# EAGLE design ai_spectra (EAGLE 6.5.0)

## Sheet 1 of 2
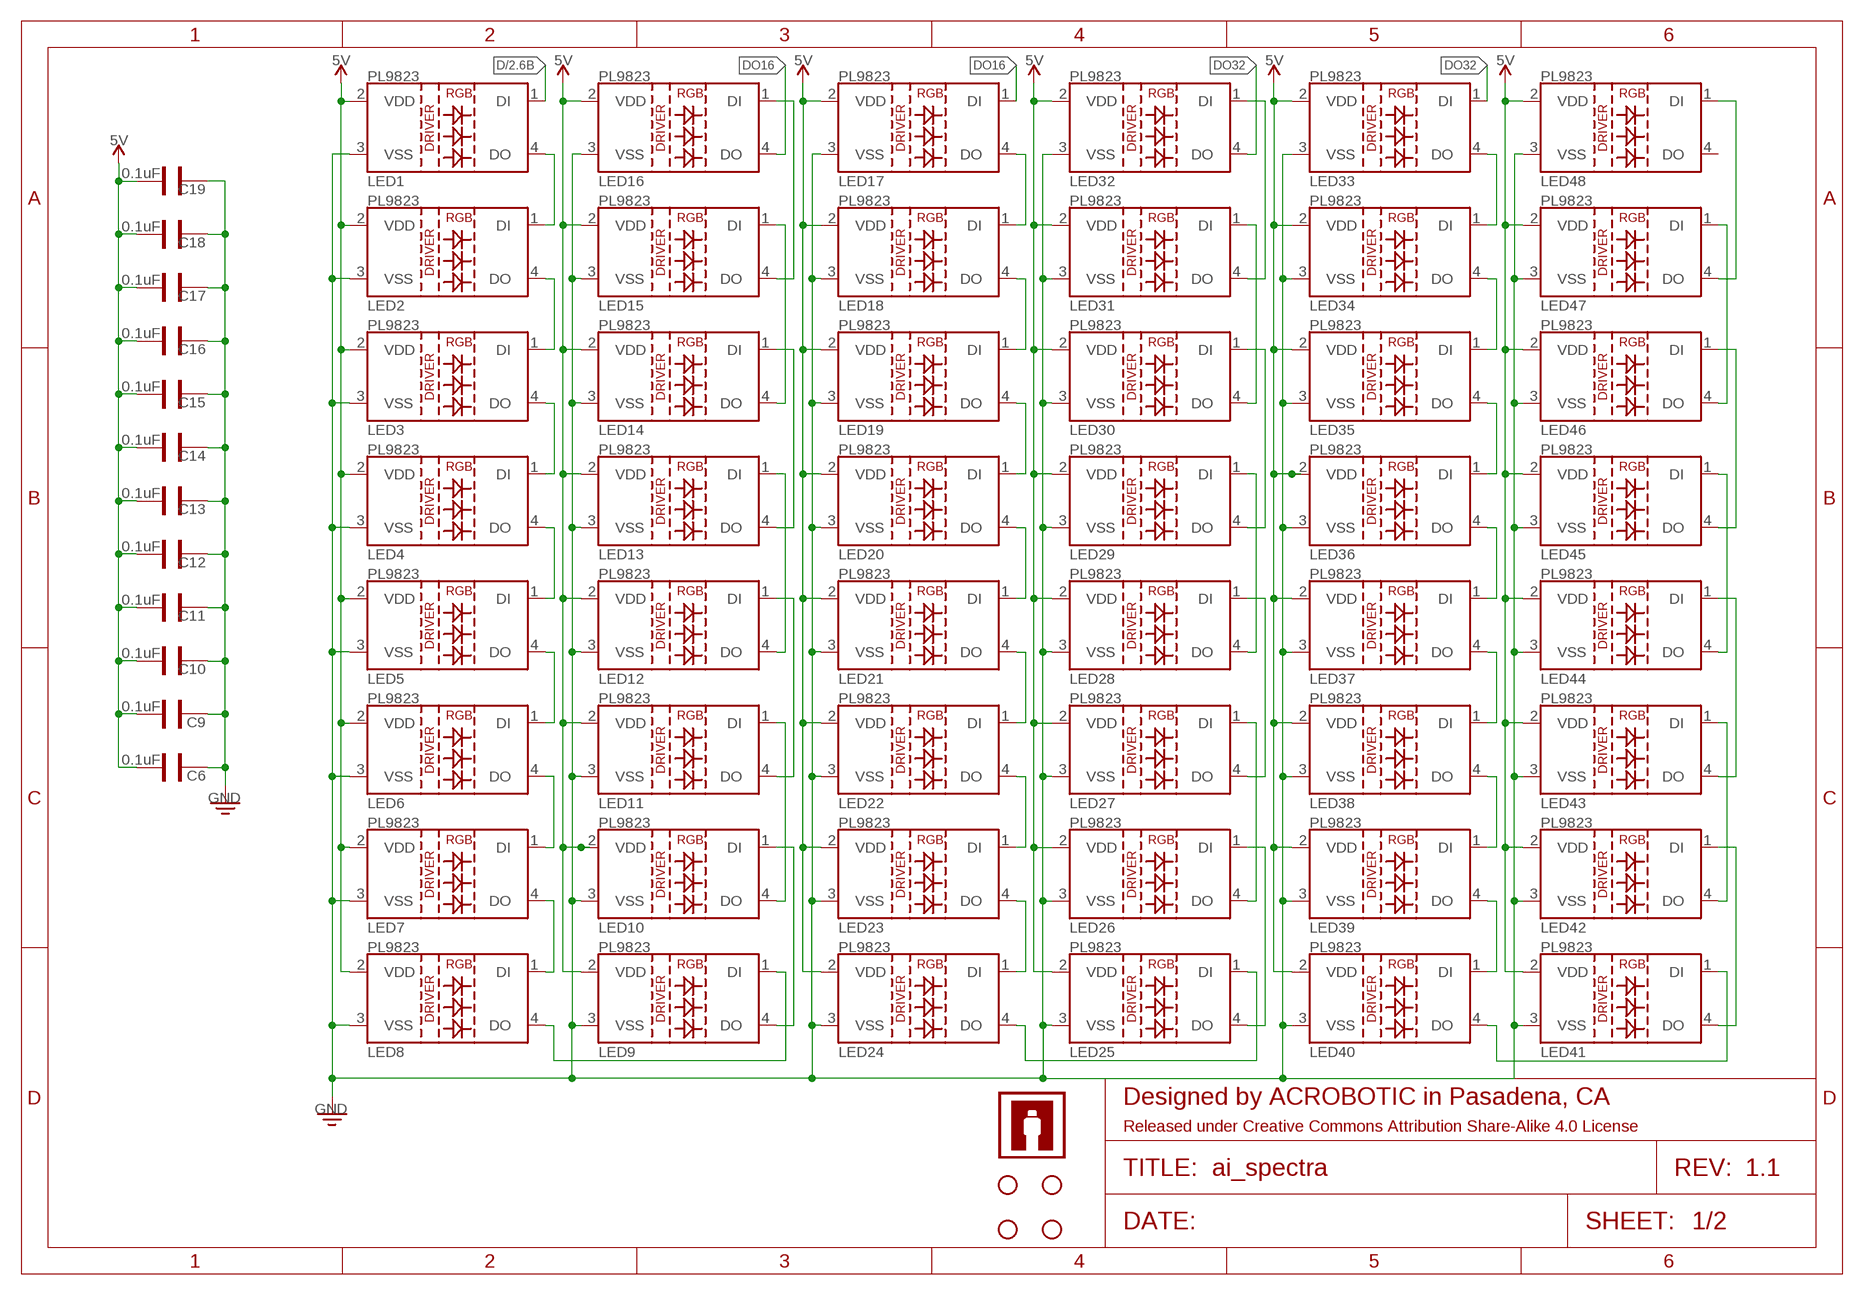
[diagram p0: schematic, sheet 1]

### Parts
C6  0.1uF  CAP025X050  [CAP-025X050]
C9  0.1uF  CAP025X050  [CAP-025X050]
C10  0.1uF  CAP025X050  [CAP-025X050]
C11  0.1uF  CAP025X050  [CAP-025X050]
C12  0.1uF  CAP025X050  [CAP-025X050]
C13  0.1uF  CAP025X050  [CAP-025X050]
C14  0.1uF  CAP025X050  [CAP-025X050]
C15  0.1uF  CAP025X050  [CAP-025X050]
C16  0.1uF  CAP025X050  [CAP-025X050]
C17  0.1uF  CAP025X050  [CAP-025X050]
C18  0.1uF  CAP025X050  [CAP-025X050]
C19  0.1uF  CAP025X050  [CAP-025X050]
FRAME1  FRAME-LETTER  [CREATIVE-COMMONS]
LED1  LED-PL9823-F8  [LED-PL9823-F8]
LED2  LED-PL9823-F8  [LED-PL9823-F8]
LED3  LED-PL9823-F8  [LED-PL9823-F8]
LED4  LED-PL9823-F8  [LED-PL9823-F8]
LED5  LED-PL9823-F8  [LED-PL9823-F8]
LED6  LED-PL9823-F8  [LED-PL9823-F8]
LED7  LED-PL9823-F8  [LED-PL9823-F8]
LED8  LED-PL9823-F8  [LED-PL9823-F8]
LED9  LED-PL9823-F8  [LED-PL9823-F8]
LED10  LED-PL9823-F8  [LED-PL9823-F8]
LED11  LED-PL9823-F8  [LED-PL9823-F8]
LED12  LED-PL9823-F8  [LED-PL9823-F8]
LED13  LED-PL9823-F8  [LED-PL9823-F8]
LED14  LED-PL9823-F8  [LED-PL9823-F8]
LED15  LED-PL9823-F8  [LED-PL9823-F8]
LED16  LED-PL9823-F8  [LED-PL9823-F8]
LED17  LED-PL9823-F8  [LED-PL9823-F8]
LED18  LED-PL9823-F8  [LED-PL9823-F8]
LED19  LED-PL9823-F8  [LED-PL9823-F8]
LED20  LED-PL9823-F8  [LED-PL9823-F8]
LED21  LED-PL9823-F8  [LED-PL9823-F8]
LED22  LED-PL9823-F8  [LED-PL9823-F8]
LED23  LED-PL9823-F8  [LED-PL9823-F8]
LED24  LED-PL9823-F8  [LED-PL9823-F8]
LED25  LED-PL9823-F8  [LED-PL9823-F8]
LED26  LED-PL9823-F8  [LED-PL9823-F8]
LED27  LED-PL9823-F8  [LED-PL9823-F8]
LED28  LED-PL9823-F8  [LED-PL9823-F8]
LED29  LED-PL9823-F8  [LED-PL9823-F8]
LED30  LED-PL9823-F8  [LED-PL9823-F8]
LED31  LED-PL9823-F8  [LED-PL9823-F8]
LED32  LED-PL9823-F8  [LED-PL9823-F8]
LED33  LED-PL9823-F8  [LED-PL9823-F8]
LED34  LED-PL9823-F8  [LED-PL9823-F8]
LED35  LED-PL9823-F8  [LED-PL9823-F8]
LED36  LED-PL9823-F8  [LED-PL9823-F8]
LED37  LED-PL9823-F8  [LED-PL9823-F8]
LED38  LED-PL9823-F8  [LED-PL9823-F8]
LED39  LED-PL9823-F8  [LED-PL9823-F8]
LED40  LED-PL9823-F8  [LED-PL9823-F8]
LED41  LED-PL9823-F8  [LED-PL9823-F8]
LED42  LED-PL9823-F8  [LED-PL9823-F8]
LED43  LED-PL9823-F8  [LED-PL9823-F8]
LED44  LED-PL9823-F8  [LED-PL9823-F8]
LED45  LED-PL9823-F8  [LED-PL9823-F8]
LED46  LED-PL9823-F8  [LED-PL9823-F8]
LED47  LED-PL9823-F8  [LED-PL9823-F8]
LED48  LED-PL9823-F8  [LED-PL9823-F8]
STANDOFF1  STAND-OFF4  [STAND-OFF-4]
STANDOFF2  STAND-OFF4  [STAND-OFF-4]
STANDOFF3  STAND-OFF4  [STAND-OFF-4]
STANDOFF4  STAND-OFF4  [STAND-OFF-4]
U$18  AI-LOGOXS  [AI-LOGO-XS]

### Nets
5V [PWR]: C6.1 C9.1 C10.1 C11.1 C12.1 C13.1 C14.1 C15.1 C16.1 C17.1 C18.1 C19.1 LED1.2(VDD) LED2.2(VDD) LED3.2(VDD) LED4.2(VDD) LED5.2(VDD) LED6.2(VDD) LED7.2(VDD) LED8.2(VDD) LED9.2(VDD) LED10.2(VDD) LED11.2(VDD) LED12.2(VDD) LED13.2(VDD) LED14.2(VDD) LED15.2(VDD) LED16.2(VDD) LED17.2(VDD) LED18.2(VDD) LED19.2(VDD) LED20.2(VDD) LED21.2(VDD) LED22.2(VDD) LED23.2(VDD) LED24.2(VDD) LED25.2(VDD) LED26.2(VDD) LED27.2(VDD) LED28.2(VDD) LED29.2(VDD) LED30.2(VDD) LED31.2(VDD) LED32.2(VDD) LED33.2(VDD) LED34.2(VDD) LED35.2(VDD) LED36.2(VDD) LED37.2(VDD) LED38.2(VDD) LED39.2(VDD) LED40.2(VDD) LED41.2(VDD) LED42.2(VDD) LED43.2(VDD) LED44.2(VDD) LED45.2(VDD) LED46.2(VDD) LED47.2(VDD) LED48.2(VDD) ; also sheet 2
D: LED1.1(DI) ; also sheet 2
DO8: LED8.4(DO) LED9.1(DI)
DO16: LED16.4(DO) LED17.1(DI)
DO24: LED24.4(DO) LED25.1(DI)
DO32: LED32.4(DO) LED33.1(DI)
GND: C6.2 C9.2 C10.2 C11.2 C12.2 C13.2 C14.2 C15.2 C16.2 C17.2 C18.2 C19.2 LED1.3(VSS) LED2.3(VSS) LED3.3(VSS) LED4.3(VSS) LED5.3(VSS) LED6.3(VSS) LED7.3(VSS) LED8.3(VSS) LED9.3(VSS) LED10.3(VSS) LED11.3(VSS) LED12.3(VSS) LED13.3(VSS) LED14.3(VSS) LED15.3(VSS) LED16.3(VSS) LED17.3(VSS) LED18.3(VSS) LED19.3(VSS) LED20.3(VSS) LED21.3(VSS) LED22.3(VSS) LED23.3(VSS) LED24.3(VSS) LED25.3(VSS) LED26.3(VSS) LED27.3(VSS) LED28.3(VSS) LED29.3(VSS) LED30.3(VSS) LED31.3(VSS) LED32.3(VSS) LED33.3(VSS) LED34.3(VSS) LED35.3(VSS) LED36.3(VSS) LED37.3(VSS) LED38.3(VSS) LED39.3(VSS) LED40.3(VSS) LED41.3(VSS) LED42.3(VSS) LED43.3(VSS) LED44.3(VSS) LED45.3(VSS) LED46.3(VSS) LED47.3(VSS) LED48.3(VSS) ; also sheet 2
N$2: LED1.4(DO) LED2.1(DI)
N$6: LED2.4(DO) LED3.1(DI)
N$8: LED3.4(DO) LED4.1(DI)
N$9: LED4.4(DO) LED5.1(DI)
N$10: LED5.4(DO) LED6.1(DI)
N$11: LED6.4(DO) LED7.1(DI)
N$14: LED7.4(DO) LED8.1(DI)
N$16: LED9.4(DO) LED10.1(DI)
N$17: LED10.4(DO) LED11.1(DI)
N$18: LED11.4(DO) LED12.1(DI)
N$19: LED12.4(DO) LED13.1(DI)
N$20: LED13.4(DO) LED14.1(DI)
N$21: LED14.4(DO) LED15.1(DI)
N$22: LED15.4(DO) LED16.1(DI)
N$24: LED33.4(DO) LED34.1(DI)
N$25: LED17.4(DO) LED18.1(DI)
N$26: LED18.4(DO) LED19.1(DI)
N$27: LED19.4(DO) LED20.1(DI)
N$28: LED20.4(DO) LED21.1(DI)
N$29: LED21.4(DO) LED22.1(DI)
N$30: LED22.4(DO) LED23.1(DI)
N$31: LED23.4(DO) LED24.1(DI)
N$32: LED34.4(DO) LED35.1(DI)
N$33: LED35.4(DO) LED36.1(DI)
N$34: LED36.4(DO) LED37.1(DI)
N$35: LED37.4(DO) LED38.1(DI)
N$36: LED38.4(DO) LED39.1(DI)
N$37: LED39.4(DO) LED40.1(DI)
N$38: LED40.4(DO) LED41.1(DI)
N$39: LED25.4(DO) LED26.1(DI)
N$40: LED26.4(DO) LED27.1(DI)
N$41: LED27.4(DO) LED28.1(DI)
N$42: LED28.4(DO) LED29.1(DI)
N$43: LED29.4(DO) LED30.1(DI)
N$44: LED30.4(DO) LED31.1(DI)
N$45: LED31.4(DO) LED32.1(DI)
N$46: LED41.4(DO) LED42.1(DI)
N$47: LED42.4(DO) LED43.1(DI)
N$48: LED43.4(DO) LED44.1(DI)
N$49: LED44.4(DO) LED45.1(DI)
N$50: LED45.4(DO) LED46.1(DI)
N$51: LED46.4(DO) LED47.1(DI)
N$52: LED47.4(DO) LED48.1(DI)
Unconnected: LED48.4(DO)

## Sheet 2 of 2
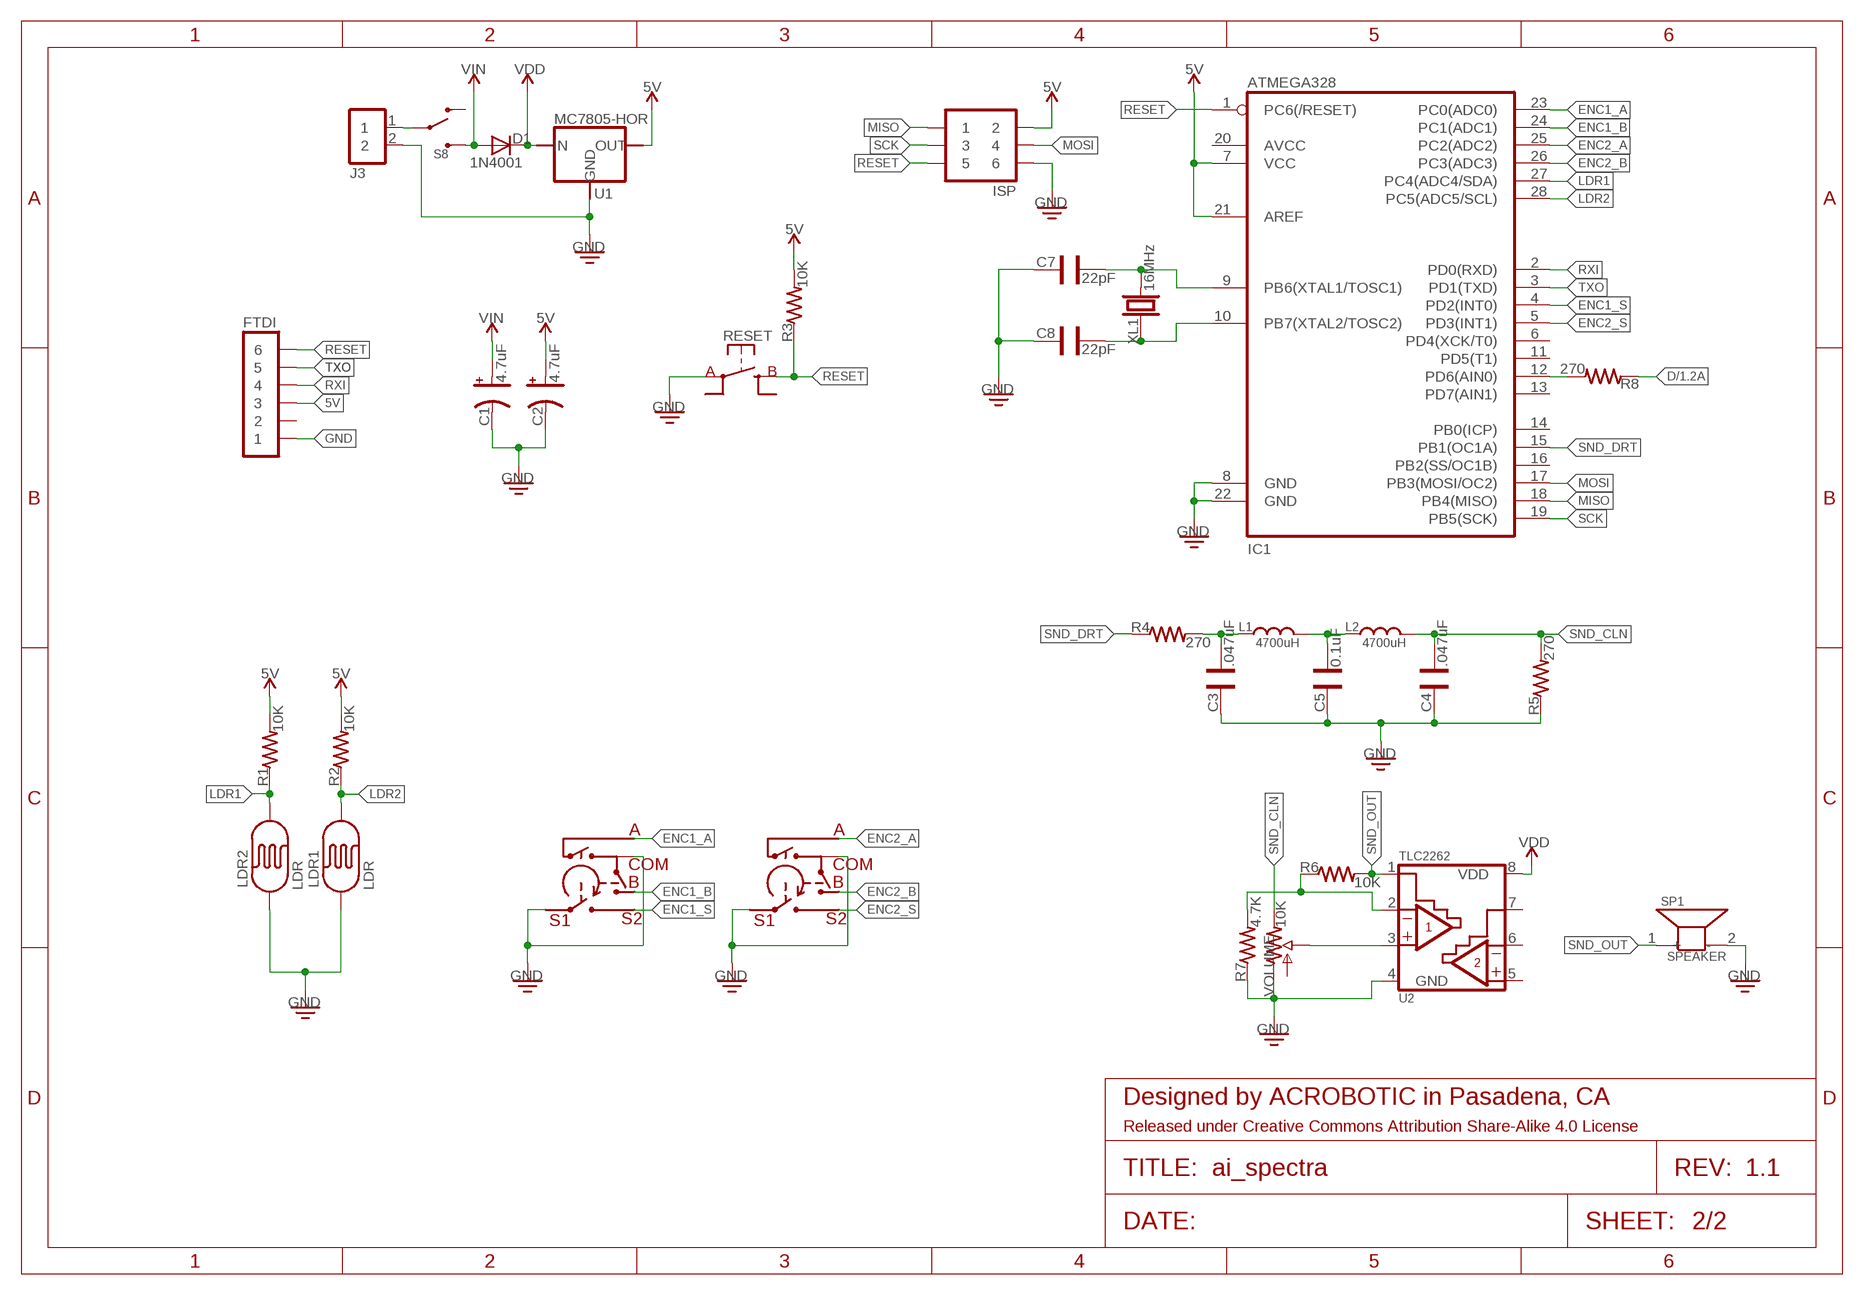
[diagram p1: schematic, sheet 2]

### Parts
C1  4.7uF  CAP-POL025X50  [CAP-POL-025X50]
C2  4.7uF  CAP-POL025X50  [CAP-POL-025X50]
C3  .047uF  CAP025X050  [CAP-025X050]
C4  .047uF  CAP025X050  [CAP-025X050]
C5  0.1uF  CAP025X050  [CAP-025X050]
C7  22pF  CAP025X050  [CAP-025X050]
C8  22pF  CAP025X050  [CAP-025X050]
D1  1N4001  DIODETH-1N914  [TH-1N914]
ENC1  ROT-ENC  [ROTENC-12MM-SW]
ENC2  ROT-ENC  [ROTENC-12MM-SW]
FRAME2  FRAME-LETTER  [CREATIVE-COMMONS]
FTDI  1X06  [1X06]
IC1  ATMEGA328P-PDIP  [DIL28]
ISP  2X03  [2X03]
J3  1X02ST  [1X02-ST]
L1  4700uH  INDRLB0912  [RLB0912]
L2  4700uH  INDRLB0912  [RLB0912]
LDR1  LDR-PTH  [LDR]
LDR2  LDR-PTH  [LDR]
R1  10K  RESAXIAL-0.4  [RES-AXIAL-0.4]
R2  10K  RESAXIAL-0.4  [RES-AXIAL-0.4]
R3  10K  RESAXIAL-0.4  [RES-AXIAL-0.4]
R4  270  RESAXIAL-0.4  [RES-AXIAL-0.4]
R5  270  RESAXIAL-0.4  [RES-AXIAL-0.4]
R6  10K  RESAXIAL-0.4  [RES-AXIAL-0.4]
R7  4.7K  RESAXIAL-0.4  [RES-AXIAL-0.4]
R8  270  RESAXIAL-0.4  [RES-AXIAL-0.4]
RESET  SW-SPSTTH06X06  [SW-SPST-TH06X06]
S8  SW-SPDTTH  [SW-SPDT-TH]
SP1  SPEAKER  [AL30P]
U1  MC7805-HOR  [TO220]
U2  TLC2262  [DIL08]
VOLUME  10K  POT05X05  [POT-05X05]
XL1  16MHz  CRYSTALHC49S  [HC49S]

### Nets
5V [PWR]: C2.A FTDI.3 IC1.7(VCC) IC1.21(AREF) ISP.2 R1.P$2 R2.P$2 R3.P$2 U1.OUT ; also sheet 1
D: R8.P$1 ; also sheet 1
ENC1_A: ENC1.P3(A) IC1.23(PC0(ADC0))
ENC1_B: ENC1.P1(B) IC1.24(PC1(ADC1))
ENC1_S: ENC1.P5(S2) IC1.4(PD2(INT0))
ENC2_A: ENC2.P3(A) IC1.25(PC2(ADC2))
ENC2_B: ENC2.P1(B) IC1.26(PC3(ADC3))
ENC2_S: ENC2.P5(S2) IC1.5(PD3(INT1))
GND: C1.C C2.C C3.2 C4.2 C5.2 C7.2 C8.2 ENC1.P2(COM) ENC1.P4(S1) ENC2.P2(COM) ENC2.P4(S1) FTDI.1 IC1.8(GND) IC1.22(GND) ISP.6 J3.2 LDR1.1 LDR2.1 R5.P$1 R7.P$1 RESET.A@1(A) SP1.2(-) U1.GND U2.4(GND) VOLUME.3(A) ; also sheet 1
LDR1: IC1.27(PC4(ADC4/SDA)) LDR2.2 R1.P$1
LDR2: IC1.28(PC5(ADC5/SCL)) LDR1.2 R2.P$1
MISO: IC1.18(PB4(MISO)) ISP.1
MOSI: IC1.17(PB3(MOSI/OC2)) ISP.4
N$1: U2.3(1IN+) VOLUME.2(S)
N$3: C8.1 IC1.10(PB7(XTAL2/TOSC2)) XL1.1
N$4: C7.1 IC1.9(PB6(XTAL1/TOSC1)) XL1.2
N$5: J3.1 S8.2(COM)
N$12: C3.1 L1.2 R4.P$2
N$13: C5.1 L1.1 L2.2
N$15: R6.P$1 R7.P$2 U2.2(1IN-)
N$53: IC1.12(PD6(AIN0)) R8.P$2
RESET: FTDI.6 IC1.1(PC6(/RESET)) ISP.5 R3.P$1 RESET.B@1(B)
RXI: FTDI.4 IC1.2(PD0(RXD))
SCK: IC1.19(PB5(SCK)) ISP.3
SND_CLN: C4.1 L2.1 R5.P$2 VOLUME.1(E)
SND_DRT: IC1.15(PB1(OC1A)) R4.P$1
SND_OUT: R6.P$2 SP1.1(+) U2.1(1OUT)
TXO: FTDI.5 IC1.3(PD1(TXD))
VDD: D1.C U1.IN U2.8(VDD)
VIN [PWR]: C1.A D1.A S8.3(L2)
Unconnected: FTDI.2 IC1.6(PD4(XCK/T0)) IC1.11(PD5(T1)) IC1.13(PD7(AIN1)) IC1.14(PB0(ICP)) IC1.16(PB2(SS/OC1B)) IC1.20(AVCC) S8.1(L1) U2.5(2IN+) U2.6(2IN-) U2.7(2OUT)

## Library data of the parts
C1 C2 = Ai_Passives:CAP-POL
C3-C19 = Ai_Passives:CAP
D1 = Ai_DiscreteSemis:DIODE
ENC1 ENC2 = Ai_Passives:ROT-ENC
FRAME1 FRAME2 = Ai_Miscellany:FRAME-LETTER: Schematic Frame A4 (8.5x11) US Letter frame based on the built-in A4-LOC frame.; REV: 1.1
FTDI = Ai_Connectors:1X06
IC1 = Ai_IC:ATMEGA328P-PDIP: ATMega328p Microcontroller used in the Arduino Uno R3. Dual In-line package 28-pin version.
ISP = Ai_Connectors:2X03
J3 = Ai_Connectors:1X02
L1 L2 = Ai_Passives:IND
LDR1 LDR2 = Ai_Sensors:LDR
LED1-LED48 = Ai_LED:LED-PL9823
R1-R8 = Ai_Passives:RES: Part # blah Digikey
RESET = Ai_Electromechanical:SW-SPST
S8 = Ai_Electromechanical:SW-SPDT
SP1 = Ai_Electromechanical:SPEAKER
STANDOFF1-STANDOFF4 = Ai_Electromechanical:STAND-OFF: Size #4
U1 = Ai_Power:MC7805: LDO voltage regulator in TO-220 package.
U2 = Ai_IC:TLC2262: Dual OP-AMP Standard dual package.
U$18 = Ai_Miscellany:AI-LOGO
VOLUME = Ai_Passives:POT
XL1 = Ai_FrequencyControl:CRYSTAL: Cylinder: CMR200T-32.768KDZBT

## Net classes
1 PWR: width 0.406 mm

## Board
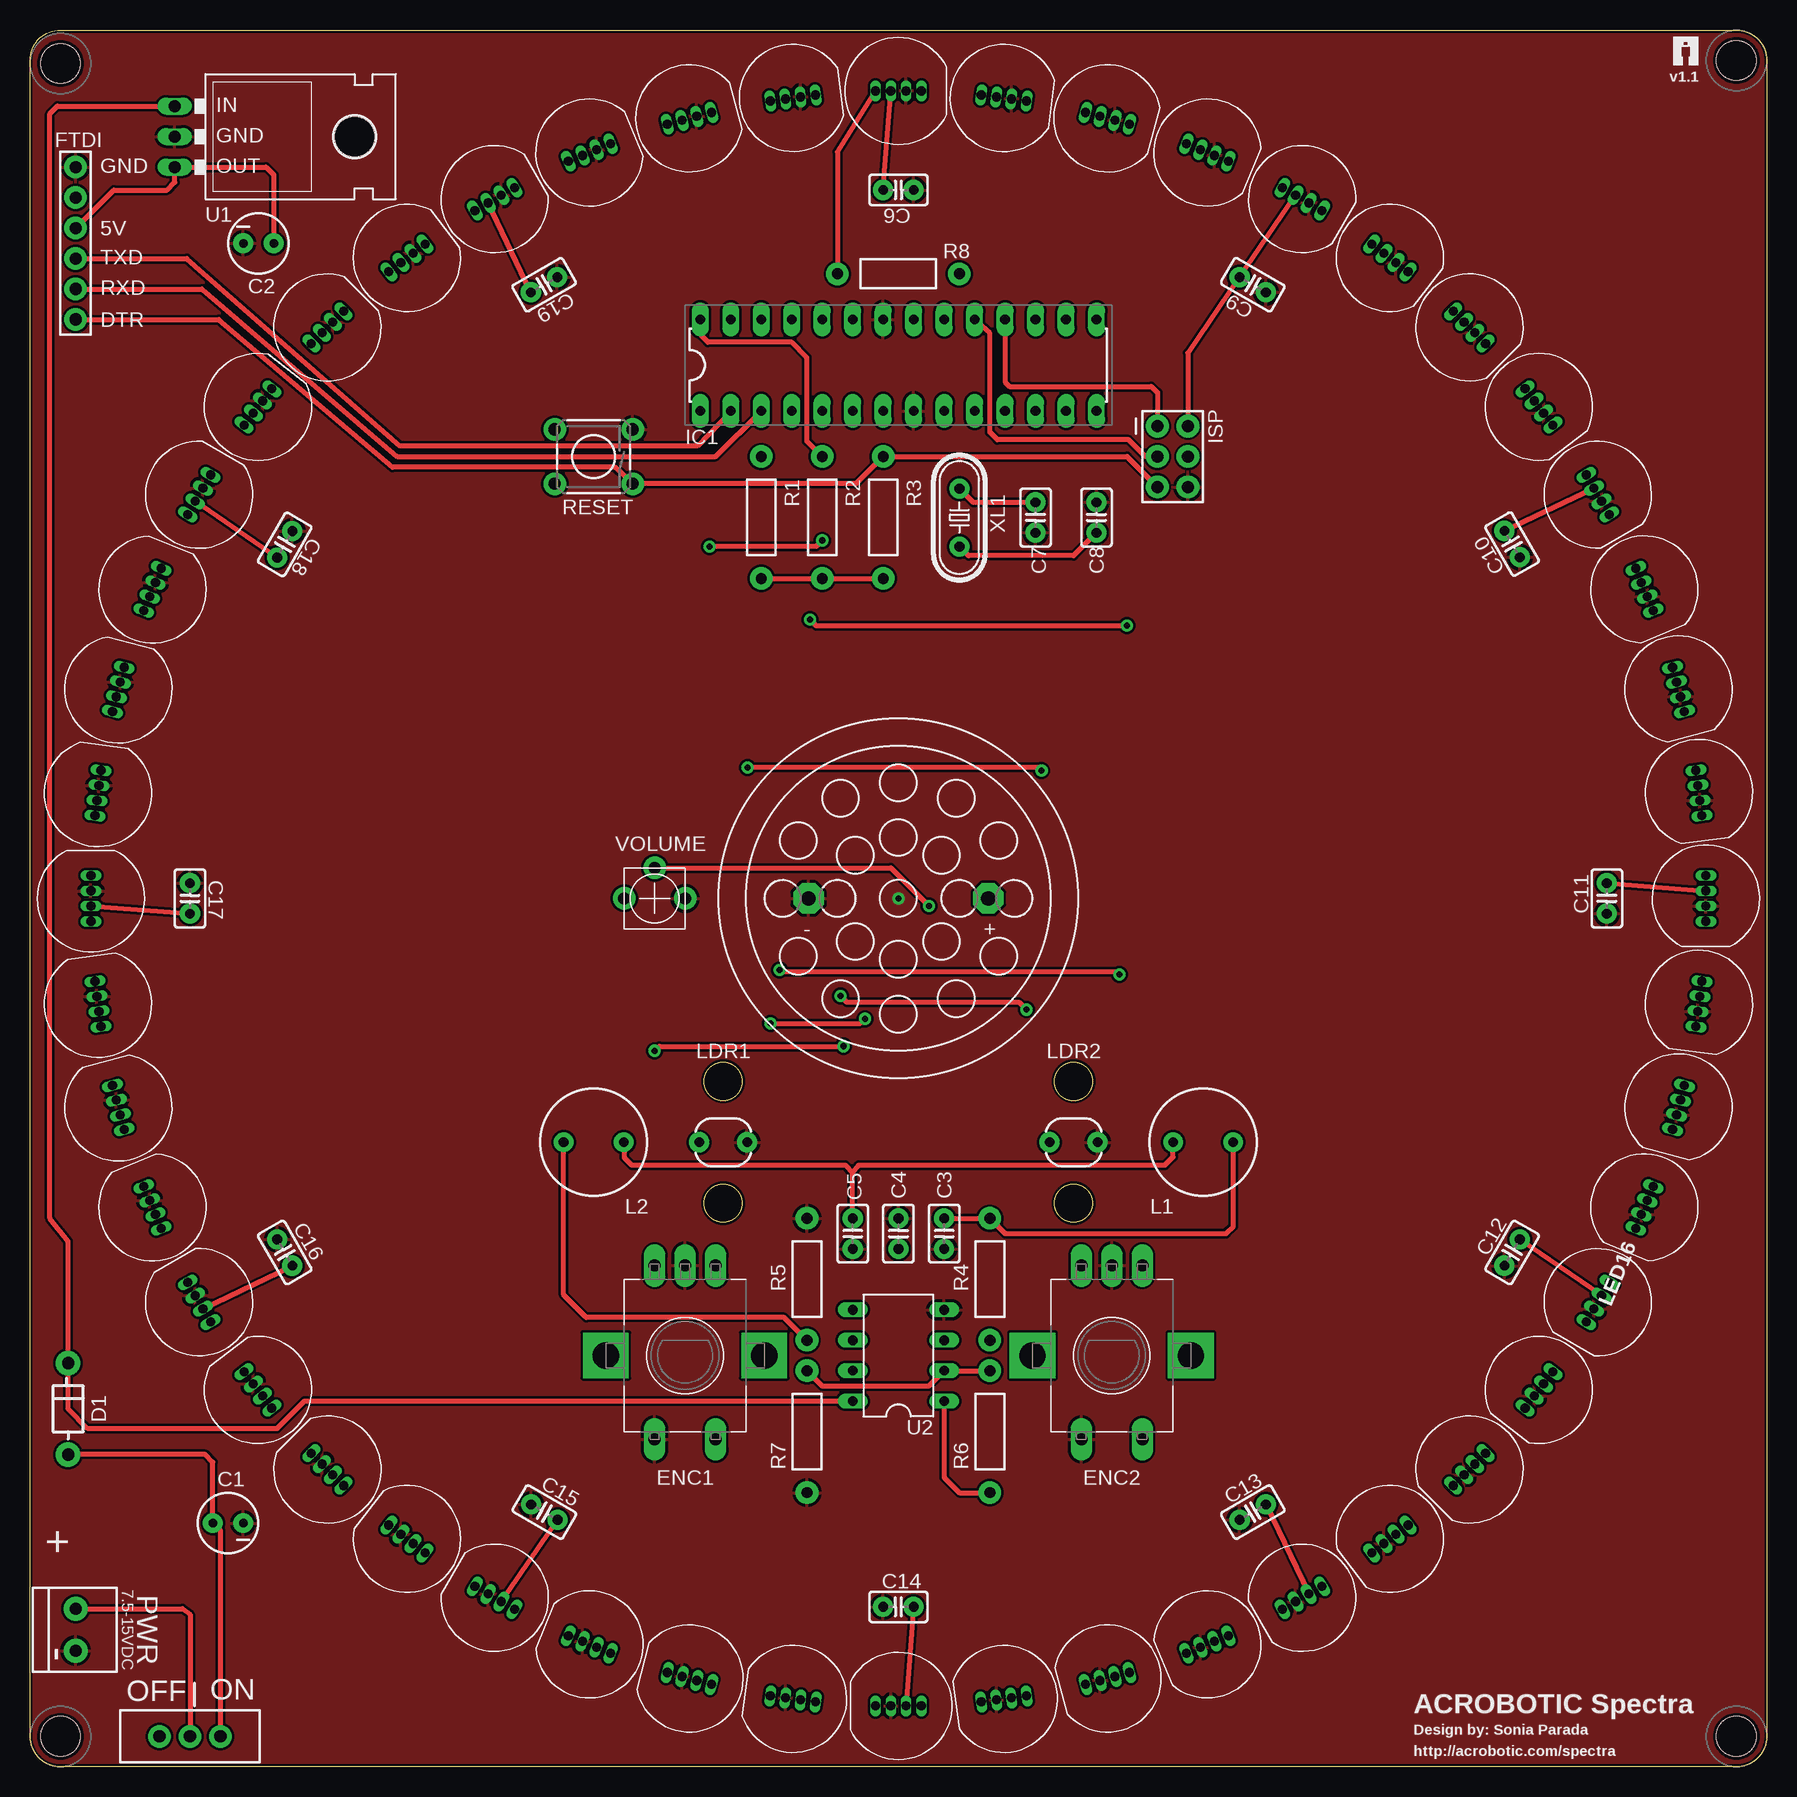
[diagram p2: board, top side]
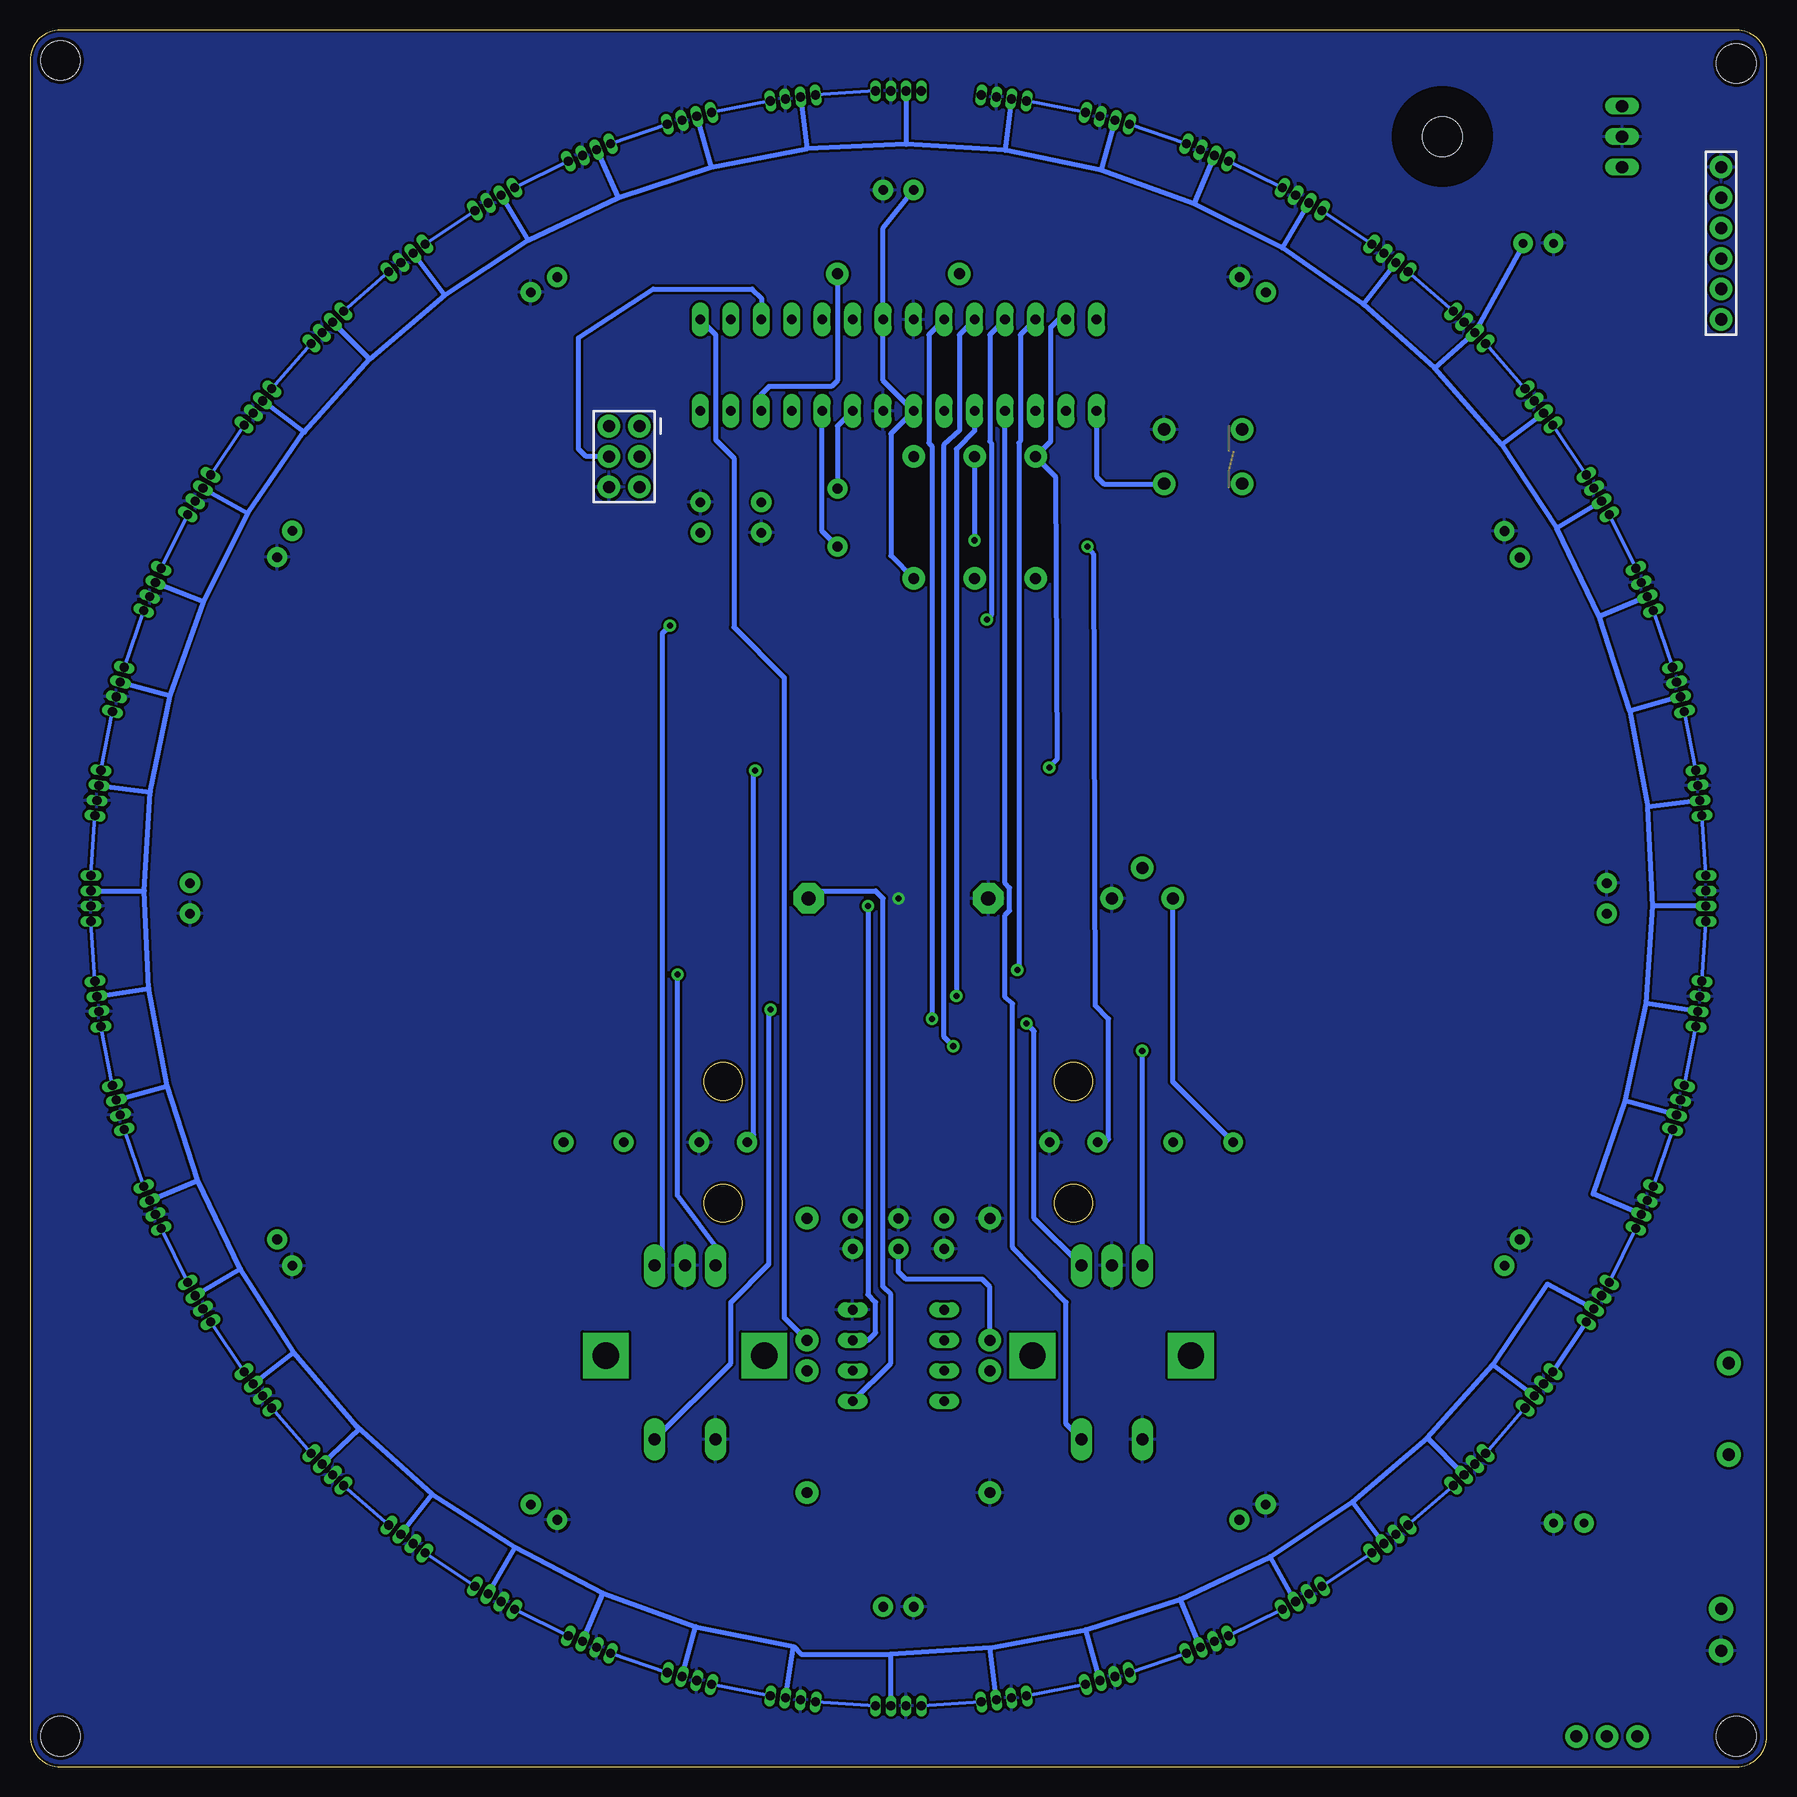
[diagram p3: board, bottom side, seen from below]

Size 144.78 x 144.78 mm. Coordinates in mm from the lower left corner, seen from the top.
Outline: 142.24,0 2.54,0 arc-90 0,2.54 0,142.24 arc-90 2.54,144.78 142.24,144.78 arc-90 144.78,142.24 144.78,2.54 arc-90 142.24,0
Outline: circle at 57.78,57.15 radius 1.59
Outline: circle at 57.78,46.99 radius 1.59
Outline: circle at 87,57.15 radius 1.59
Outline: circle at 87,46.99 radius 1.59
Copper layers (1*16): Top 0.035mm / dielectric 1.5mm / Bottom 0.035mm
Design rules "ai_2layer *": minimum track width 7mil, minimum drill 15mil, track to track 8mil, track to pad 8mil, pad to pad 8mil, via to via 8mil, smd to smd 8mil, copper to edge 8mil, drill to drill 8mil, minimum pad ring 0mil, minimum via ring 10mil, stop-mask expansion 4mil, vias tented up to drill 20mil, thermal gap 10mil

### Footprints (pad centres in the part's own frame; a part is rotated, then mirrored left to right if it is on the bottom)
CAP-POL-025X50 = drill 0.7 pad 1.651: A 1.27,0; C -1.27,0
CAP-025X050 = drill 0.813 pad 1.676: 1 -1.27,0; 2 1.27,0
TH-1N914 = drill 1.016 pad 2.032: A -3.81,0; C 3.81,0
ROTENC-12MM-SW = drill 2.2 pad 3.81 square: NC1 0,6.604; NC2 0,-6.604 | drill 1 pad 1.778 long: P1 7.493,2.54; P2 7.493,0; P3 7.493,-2.54; P4 -6.985,2.54; P5 -6.985,-2.54
1X06 = drill 1.016 pad 1.88: 1 -6.35,0; 2 -3.81,0; 3 -1.27,0; 4 1.27,0; 5 3.81,0; 6 6.35,0
DIL28 = drill 0.813 pad 1.422 long: 1 -16.51,-3.81; 2 -13.97,-3.81; 3 -11.43,-3.81; 4 -8.89,-3.81; 5 -6.35,-3.81; 6 -3.81,-3.81; 7 -1.27,-3.81; 8 1.27,-3.81; 9 3.81,-3.81; 10 6.35,-3.81; 11 8.89,-3.81; 12 11.43,-3.81; 13 13.97,-3.81; 14 16.51,-3.81; 15 16.51,3.81; 16 13.97,3.81; 17 11.43,3.81; 18 8.89,3.81; 19 6.35,3.81; 20 3.81,3.81; 21 1.27,3.81; 22 -1.27,3.81; 23 -3.81,3.81; 24 -6.35,3.81; 25 -8.89,3.81; 26 -11.43,3.81; 27 -13.97,3.81; 28 -16.51,3.81
2X03 = drill 1.016 pad 1.88: 1 -2.54,-1.27; 2 -2.54,1.27; 3 0,-1.27; 4 0,1.27; 5 2.54,-1.27; 6 2.54,1.27
1X02-ST = drill 1.016 pad 2.032: 1 -1.75,0; 2 1.75,0
RLB0912 = drill 0.813 pad 1.651: 1 2.502,0; 2 -2.502,0
LDR = drill 0.8 pad 1.676: 1 -2,0; 2 2,0
LED-PL9823-F8 = drill 0.762 pad 0.889 long: 1 -1.905,0; 2 -0.635,0; 3 0.635,0; 4 1.905,0
RES-AXIAL-0.4 = drill 0.9 pad 1.88: P$1 -5.08,0; P$2 5.08,0
SW-SPST-TH06X06 = drill 1.016 pad 1.88: A@1 -3.251,-2.261; A@2 3.251,-2.261; B@1 -3.251,2.261; B@2 3.251,2.261
SW-SPDT-TH = drill 1.016 pad 1.88: 1 0,2.54; 2 0,0; 3 0,-2.54
AL30P = drill 1.194 pad 2.54 octagon: 1 -7.493,0; 2 7.493,0
STAND-OFF-4 = hole 3.302: 0,0
TO220 = drill 1.016 pad 1.422 long: GND 0,-6.985; IN -2.54,-6.985; OUT 2.54,-6.985 | hole 3.302: 0,8.001
DIL08 = drill 0.813 pad 1.27 long: 1 -3.81,-3.81; 2 -1.27,-3.81; 3 1.27,-3.81; 4 3.81,-3.81; 5 3.81,3.81; 6 1.27,3.81; 7 -1.27,3.81; 8 -3.81,3.81
POT-05X05 = drill 1 pad 1.88: 1 -2.54,0; 2 0,2.54; 3 2.54,0
HC49S = drill 0.813 pad 1.676: 1 -2.413,0; 2 2.413,0

### Placement (x,y rotation side)
C1  16.51,20.32 180 top
C2  19.05,127 0 top
C3  76.2,44.45 270 top
C4  72.39,44.45 90 top
C5  68.58,44.45 270 top
C6  72.39,131.44 0 top
C7  83.82,104.14 270 top
C8  88.9,104.14 90 top
C9  101.93,123.55 330 top
C10  123.55,101.93 300 top
C11  131.44,72.39 270 top
C12  123.55,42.88 240 top
C13  101.93,21.23 210 top
C14  72.39,13.34 180 top
C15  42.88,21.23 150 top
C16  21.23,42.88 120 top
C17  13.34,72.39 90 top
C18  21.23,101.9 60 top
C19  42.85,123.55 30 top
D1  3.17,29.84 90 top
ENC1  54.61,34.29 90 top
ENC2  90.17,34.29 90 top
FRAME1  72.39,-1.27 0 top
FRAME2  72.39,-1.27 0 top
FTDI  3.81,127 270 top
IC1  72.39,116.84 0 top
ISP  95.25,109.22 270 top
J3  3.81,11.43 270 top
L1  97.79,52.07 180 top
L2  46.99,52.07 180 top
LDR1  57.78,52.07 180 top
LDR2  87,52.07 180 top
LED1  72.39,139.7 0 top
LED2  81.18,139.12 352.5 top
LED3  89.81,137.41 345 top
LED4  98.15,134.57 337.5 top
LED5  106.05,130.68 330 top
LED6  113.36,125.78 322.5 top
LED7  119.99,119.99 315 top
LED8  125.78,113.36 307.5 top
LED9  130.68,106.05 300 top
LED10  134.57,98.15 292.5 top
LED11  137.41,89.81 285 top
LED12  139.12,81.18 277.5 top
LED13  139.7,72.39 270 top
LED14  139.12,63.6 262.5 top
LED15  137.41,54.97 255 top
LED16  134.57,46.63 247.5 top
LED17  130.68,38.73 240 top
LED18  125.78,31.42 232.5 top
LED19  119.99,24.79 225 top
LED20  113.36,19 217.5 top
LED21  106.05,14.1 210 top
LED22  98.15,10.21 202.5 top
LED23  89.81,7.37 195 top
LED24  81.18,5.66 187.5 top
LED25  72.39,5.08 180 top
LED26  63.6,5.66 172.5 top
LED27  54.97,7.37 165 top
LED28  46.63,10.21 157.5 top
LED29  38.73,14.1 150 top
LED30  31.42,19 142.5 top
LED31  24.79,24.79 135 top
LED32  19,31.42 127.5 top
LED33  14.1,38.73 120 top
LED34  10.21,46.63 112.5 top
LED35  7.37,54.97 105 top
LED36  5.66,63.6 97.5 top
LED37  5.08,72.39 90 top
LED38  5.66,81.18 82.5 top
LED39  7.37,89.81 75 top
LED40  10.21,98.15 67.5 top
LED41  14.1,106.05 60 top
LED42  19,113.36 52.5 top
LED43  24.79,119.99 45 top
LED44  31.42,125.78 37.5 top
LED45  38.73,130.68 30 top
LED46  46.63,134.57 22.5 top
LED47  54.97,137.41 15 top
LED48  63.6,139.12 7.5 top
R1  60.96,104.14 270 top
R2  66.04,104.14 270 top
R3  71.12,104.14 270 top
R4  80.01,40.64 90 top
R5  64.77,40.64 270 top
R6  80.01,27.94 270 top
R7  64.77,27.94 90 top
R8  72.39,124.46 0 top
RESET  46.99,109.22 180 top
S8  13.34,2.54 90 top
SP1  72.39,72.39 180 top
STANDOFF1  142.24,2.54 0 top
STANDOFF2  2.54,141.99 0 top
STANDOFF3  142.24,142.24 0 top
STANDOFF4  2.54,2.54 0 top
U1  19.05,135.89 270 top
U2  72.39,34.29 90 top
U$18  137.03,141.86 0 top
VOLUME  52.07,72.39 0 top
XL1  77.47,104.14 90 top

### Tracks (layer width: path | path; a pad name or v marks a point on that pad's centre or on a via)
5V
  Top 0.406: C2.A 20.32,132.72 19.68,133.35 U1.OUT 12.06,132.08 11.43,131.44 6.99,131.44 FTDI.3 | ISP.2 96.52,117.86 C9.1 LED5.2 | R1.P$2 R2.P$2 R3.P$2 | C10.1 LED9.2 | C11.1 LED13.2 | LED17.2 C12.1 | C14.1 LED25.2 | LED29.2 C15.1 | LED33.2 C16.1 | LED37.2 C17.1 | C18.1 LED41.2 | C19.1 LED45.2 | C6.1 LED1.2 | C13.1 LED21.2
  Bottom 0.406: C2.A 20.32,126.87 LED43.2 27.69,116.59 | R3.P$2 73.03,100.97 73.03,111.12 IC1.7 73.66,115.57 IC1.21 73.66,128.27 C6.1 | LED2.2 80.01,134.87 | LED3.2 88.01,133.35 | LED4.2 95.76,130.81 | LED6.2 110.24,122.68 | LED5.2 103.25,127.25 | LED7.2 116.46,117.35 | LED8.2 121.98,111.3 | 121.98,111.3 121.92,111.25 116.46,117.35 | LED9.2 126.62,104.52 | LED10.2 130.3,97.16 | LED11.2 133.1,89.28 | LED12.2 134.75,81.28 | LED13.2 135.25,73.03 | LED14.2 134.87,64.9 | LED15.2 133.35,56.77 | LED16.2 130.81,48.9 | LED17.2 127.25,41.53 | LED18.2 122.81,34.54 | LED19.2 117.35,28.19 117.49,28.36 | LED20.2 111.25,22.73 | LED22.2 97.03,14.48 | LED23.2 89.28,11.68 | LED24.2 81.15,10.03 | LED25.2 73.03,9.4 | LED27.2 56.77,11.43 | LED26.2 64.77,9.91 | LED28.2 48.9,13.97 | LED29.2 41.4,17.53 | LED30.2 34.54,22.1 | LED31.2 28.32,27.43 | LED32.2 22.86,33.53 | LED33.2 18.29,40.26 22.86,33.53 | LED34.2 14.48,47.75 11.81,55.5 | LED35.2 11.81,55.5 | LED36.2 10.03,63.63 | LED37.2 9.53,71.75 | LED38.2 9.91,80.01 | LED39.2 11.43,88.01 | LED40.2 13.97,95.89 | LED41.2 17.53,103.25 | LED42.2 22.1,110.24 | LED44.2 33.66,121.92 | LED45.2 40.39,126.62 | LED46.2 47.75,130.3 | LED47.2 55.5,133.1 | LED48.2 63.5,134.75 | LED1.2 71.75,135.25 | 63.5,134.75 71.75,135.25 | 71.75,135.25 80.01,134.87 | 88.01,133.35 80.01,134.87 | 95.76,130.81 88.01,133.35 | 103.25,127.25 95.76,130.81 | 110.24,122.68 103.25,127.25 | 116.46,117.35 110.24,122.68 | 126.62,104.52 121.98,111.3 | 130.3,97.16 126.62,104.52 | 133.1,89.28 130.3,97.16 | 134.75,81.28 133.1,89.28 | 135.25,73.03 134.75,81.28 | 134.87,64.9 135.25,73.03 | 133.35,56.77 134.87,64.9 | 130.81,48.9 133.35,56.77 | 127.25,41.53 130.81,48.9 | 122.81,34.54 127.25,41.53 | 117.49,28.36 122.81,34.54
  Bottom 0.406: 111.25,22.73 117.49,28.36 | 97.03,14.48 89.28,11.68 | LED21.2 104.33,18.3 | 97.03,14.48 104.33,18.3 | 111.25,22.73 104.33,18.3 | 89.28,11.68 81.15,10.03 | 81.15,10.03 80.52,9.4 73.03,9.4 | 64.77,9.91 73.03,9.4 | 64.77,9.91 56.77,11.43 | 56.77,11.43 48.9,13.97 | 48.9,13.97 41.4,17.53 | 41.4,17.53 34.54,22.1 | 34.54,22.1 28.32,27.43 | 28.32,27.43 22.86,33.53 | 11.81,55.5 10.03,63.63 | 10.03,63.63 9.53,71.75 | 9.53,71.75 9.91,80.01 | 11.43,88.01 9.91,80.01 | 11.43,88.01 13.97,95.89 | 13.97,95.89 17.53,103.25 | 22.1,110.24 17.53,103.25 | 22.1,110.24 27.69,116.59 | 27.69,116.59 33.66,121.92 | 33.66,121.92 40.39,126.62 | 40.39,126.62 47.75,130.3 | 47.75,130.3 55.5,133.1 | 55.5,133.1 63.5,134.75
D
  Top 0.406: LED1.1 67.31,134.62 R8.P$1
DO8
  Bottom 0.305: LED8.4 LED9.1
DO16
  Bottom 0.305: LED16.4 LED17.1
DO24
  Bottom 0.305: LED24.4 LED25.1
DO32
  Bottom 0.406: LED33.1 LED32.4
ENC1_A  (via drill 0.51)
  Top 0.406: v69.6,62.36 69.22,61.98 v61.72,61.98
  Bottom 0.406: IC1.23 69.85,119.38 69.85,110.36 69.6,110.11 v69.6,62.36 | ENC1.P3 61.09,45.72 61.09,61.34 v61.72,61.98
ENC1_B  (via drill 0.51)
  Top 0.406: v52.07,59.69 52.45,60.07 v67.82,60.07
  Bottom 0.406: ENC1.P1 v52.07,59.69 | IC1.24 67.31,119.38 67.31,111.38 68.58,110.24 68.58,60.83 v67.82,60.07
ENC1_S
  Bottom 0.406: ENC1.P5 58.42,28.57 58.42,38.73 62.87,43.31 62.87,63.63 63.5,64.14 63.5,70.99 63.12,71.37 63.12,73.28 63.5,73.66 IC1.4
ENC2_A  (via drill 0.51)
  Top 0.406: v65.02,95.63 65.53,95.12 v91.44,95.12
  Bottom 0.406: ENC2.P3 92.08,42.42 92.08,94.49 v91.44,95.12 | IC1.25 64.77,119.38 64.77,110.49 64.64,110.36 64.64,96.01 v65.02,95.63
ENC2_B  (via drill 0.51)
  Top 0.406: v62.48,66.42 62.61,66.29 90.55,66.29 v90.81,66.04
  Bottom 0.406: IC1.26 62.23,119.38 62.23,110.49 62.36,110.36 62.36,66.55 v62.48,66.42 | ENC2.P1 87.63,42.42 87,42.55 90.81,47.62 v90.81,66.04
ENC2_S  (via drill 0.51)
  Top 0.406: v67.56,64.26 68.07,63.75 82.42,63.75 v83.06,63.12
  Bottom 0.406: ENC2.P5 86.36,33.66 86.36,38.73 83.19,41.91 83.19,62.99 v83.06,63.12 | IC1.5 66.04,111.38 67.56,109.86 v67.56,64.26
GND  (via drill 0.51)
  other vias: 72.39,72.39
  pour Top: 0,0 144.78,0 144.78,144.78 0,144.78
  pour Bottom: 0,0 144.78,0 144.78,144.78 0,144.78
LDR1  (via drill 0.51)
  Top 0.406: v84.33,83.06 84.07,83.31 v59.82,83.31
  Bottom 0.406: IC1.27 59.05,120.65 59.69,120.02 59.69,110.49 R1.P$1 59.31,107.57 59.18,83.95 v59.82,83.31 | LDR2.2 84.45,52.7 84.45,82.93 v84.33,83.06
LDR2  (via drill 0.51)
  Top 0.406: R2.P$1 64.77,110.49 64.77,117.47 63.5,118.75 56.52,118.75 55.88,119.38 IC1.28 | v66.04,102.23 65.53,101.73 v56.64,101.73
  Bottom 0.406: R2.P$1 v66.04,102.23 | v56.64,101.73 56.13,101.09 56.01,63.5 54.86,62.36 54.86,52.32 55.12,52.07 LDR1.2
MISO
  Top 0.406: IC1.18 81.28,115.44 81.66,115.06 93.47,115.06 93.98,114.55 ISP.1
MOSI
  Bottom 0.406: ISP.4 98.42,109.22 99.06,109.86 99.06,119.13 92.84,123.19 84.58,123.19 83.82,122.43 IC1.17
N$1  (via drill 0.51)
  Top 0.406: VOLUME.2 71.75,74.93 v74.93,71.75
  Bottom 0.406: U2.3 74.93,35.56 74.3,36.2 74.3,38.73 74.93,39.37 v74.93,71.75
N$2
  Bottom 0.305: LED1.4 LED2.1
N$3
  Top 0.406: C8.1 87,100.97 78.23,100.97 XL1.1
  Bottom 0.406: XL1.1 78.74,103 IC1.10
N$4
  Top 0.406: XL1.2 78.61,105.41 C7.1
  Bottom 0.406: IC1.9 77.47,111.76 XL1.2
N$5
  Top 0.406: J3.1 12.73,13.18 13.34,12.7 S8.2
N$6
  Bottom 0.305: LED2.4 LED3.1
N$8
  Bottom 0.305: LED3.4 LED4.1
N$9
  Bottom 0.305: LED4.4 LED5.1
N$10
  Bottom 0.305: LED5.4 LED6.1
N$11
  Bottom 0.305: LED6.4 LED7.1
N$12
  Top 0.406: L1.2 100.29,45.05 99.69,44.45 81.28,44.45 R4.P$2 C3.1
N$13
  Top 0.406: L2.2 49.53,52.03 49.53,50.8 50.16,50.16 67.94,50.16 68.58,49.53 | C5.1 68.58,49.53 | 68.58,49.53 69.09,50.16 94.61,50.16 95.29,50.84 L1.1
N$14
  Bottom 0.305: LED7.4 LED8.1
N$15
  Top 0.406: R7.P$2 66.04,31.75 74.93,31.75 U2.2 R6.P$1
N$16
  Bottom 0.305: LED9.4 LED10.1
N$17
  Bottom 0.305: LED10.4 LED11.1
N$18
  Bottom 0.305: LED11.4 LED12.1
N$19
  Bottom 0.305: LED12.4 LED13.1
N$20
  Bottom 0.305: LED13.4 LED14.1
N$21
  Bottom 0.305: LED14.4 LED15.1
N$22
  Bottom 0.305: LED15.4 LED16.1
N$24
  Bottom 0.305: LED33.4 LED34.1
N$25
  Bottom 0.305: LED17.4 LED18.1
N$26
  Bottom 0.305: LED18.4 LED19.1
N$27
  Bottom 0.305: LED19.4 LED20.1
N$28
  Bottom 0.305: LED20.4 LED21.1
N$29
  Bottom 0.305: LED21.4 LED22.1
N$30
  Bottom 0.305: LED22.4 LED23.1
N$31
  Bottom 0.305: LED23.4 LED24.1
N$32
  Bottom 0.305: LED34.4 LED35.1
N$33
  Bottom 0.305: LED35.4 LED36.1
N$34
  Bottom 0.305: LED36.4 LED37.1
N$35
  Bottom 0.305: LED37.4 LED38.1
N$36
  Bottom 0.305: LED38.4 LED39.1
N$37
  Bottom 0.305: LED39.4 LED40.1
N$38
  Bottom 0.305: LED40.4 LED41.1
N$39
  Bottom 0.305: LED25.4 LED26.1
N$40
  Bottom 0.305: LED26.4 LED27.1
N$41
  Bottom 0.305: LED27.4 LED28.1
N$42
  Bottom 0.305: LED28.4 LED29.1
N$43
  Bottom 0.305: LED29.4 LED30.1
N$44
  Bottom 0.305: LED30.4 LED31.1
N$45
  Bottom 0.305: LED31.4 LED32.1
N$46
  Bottom 0.305: LED42.1 LED41.4
N$47
  Bottom 0.305: LED42.4 LED43.1
N$48
  Bottom 0.305: LED43.4 LED44.1
N$49
  Bottom 0.305: LED44.4 LED45.1
N$50
  Bottom 0.305: LED45.4 LED46.1
N$51
  Bottom 0.305: LED46.4 LED47.1
N$52
  Bottom 0.305: LED47.4 LED48.1
N$53
  Bottom 0.406: R8.P$2 77.47,115.57 77.98,115.06 83.19,115.06 83.82,114.43 IC1.12
RESET
  Top 0.406: FTDI.6 15.75,120.65 30.23,108.33 48.77,108.33 RESET.B@1 68.86,106.96 R3.P$1 91.44,109.22 ISP.5
  Bottom 0.406: IC1.1 55.88,107.57 55.24,106.93 50.27,106.93 RESET.B@1
RXI
  Top 0.406: FTDI.4 13.08,125.73 30.86,110.11 55.63,110.11 IC1.2
SCK
  Top 0.406: ISP.3 92.96,109.22 91.57,110.62 80.64,110.62 80.01,111.25 80.01,119.51 IC1.19
SND_CLN
  Top 0.406: R5.P$2 62.87,37.47 46.35,37.47 44.49,39.33 L2.1
  Bottom 0.406: L2.1 49.53,57.11 VOLUME.1 | R5.P$2 64.77,40.01 65.41,40.64 71.75,40.64 72.39,41.27 C4.1
SND_DRT
  Bottom 0.406: R4.P$1 81.92,37.47 81.92,90.81 86.11,95 86.11,109.09 87.63,110.62 87.63,119.38 IC1.15
SND_OUT
  Top 0.406: U2.1 76.2,24.13 77.47,22.86 R6.P$2
  Bottom 0.406: U2.1 73.03,33.66 73.03,39.37 73.66,40.01 73.66,72.39 74.3,73.03 79.25,73.03 SP1.1
TXO
  Top 0.406: FTDI.5 14.35,123.19 30.61,109.22 57.15,109.22 IC1.3
VDD
  Top 0.406: U2.8 22.86,30.48 20.57,28.19 4.83,28.19 3.17,29.84 D1.C 3.17,43.81 1.65,45.72 1.65,137.79 2.29,138.43 U1.IN
VIN
  Top 0.406: S8.3 15.88,19.68 C1.A 15.24,25.4 14.61,26.04 D1.A

### Text on the board
tPlace: v1.1 | IN | GND | GND | OUT | 5V | TXD | RXD | DTR | + | 7.5-15VDC | PWR | - | OFF | ON | ACROBOTIC Spectra | Design by: Sonia Parada | http://acrobotic.com/spectra
tDocu: Sonia P.